# Altium project HE280PCB.PrjPcb
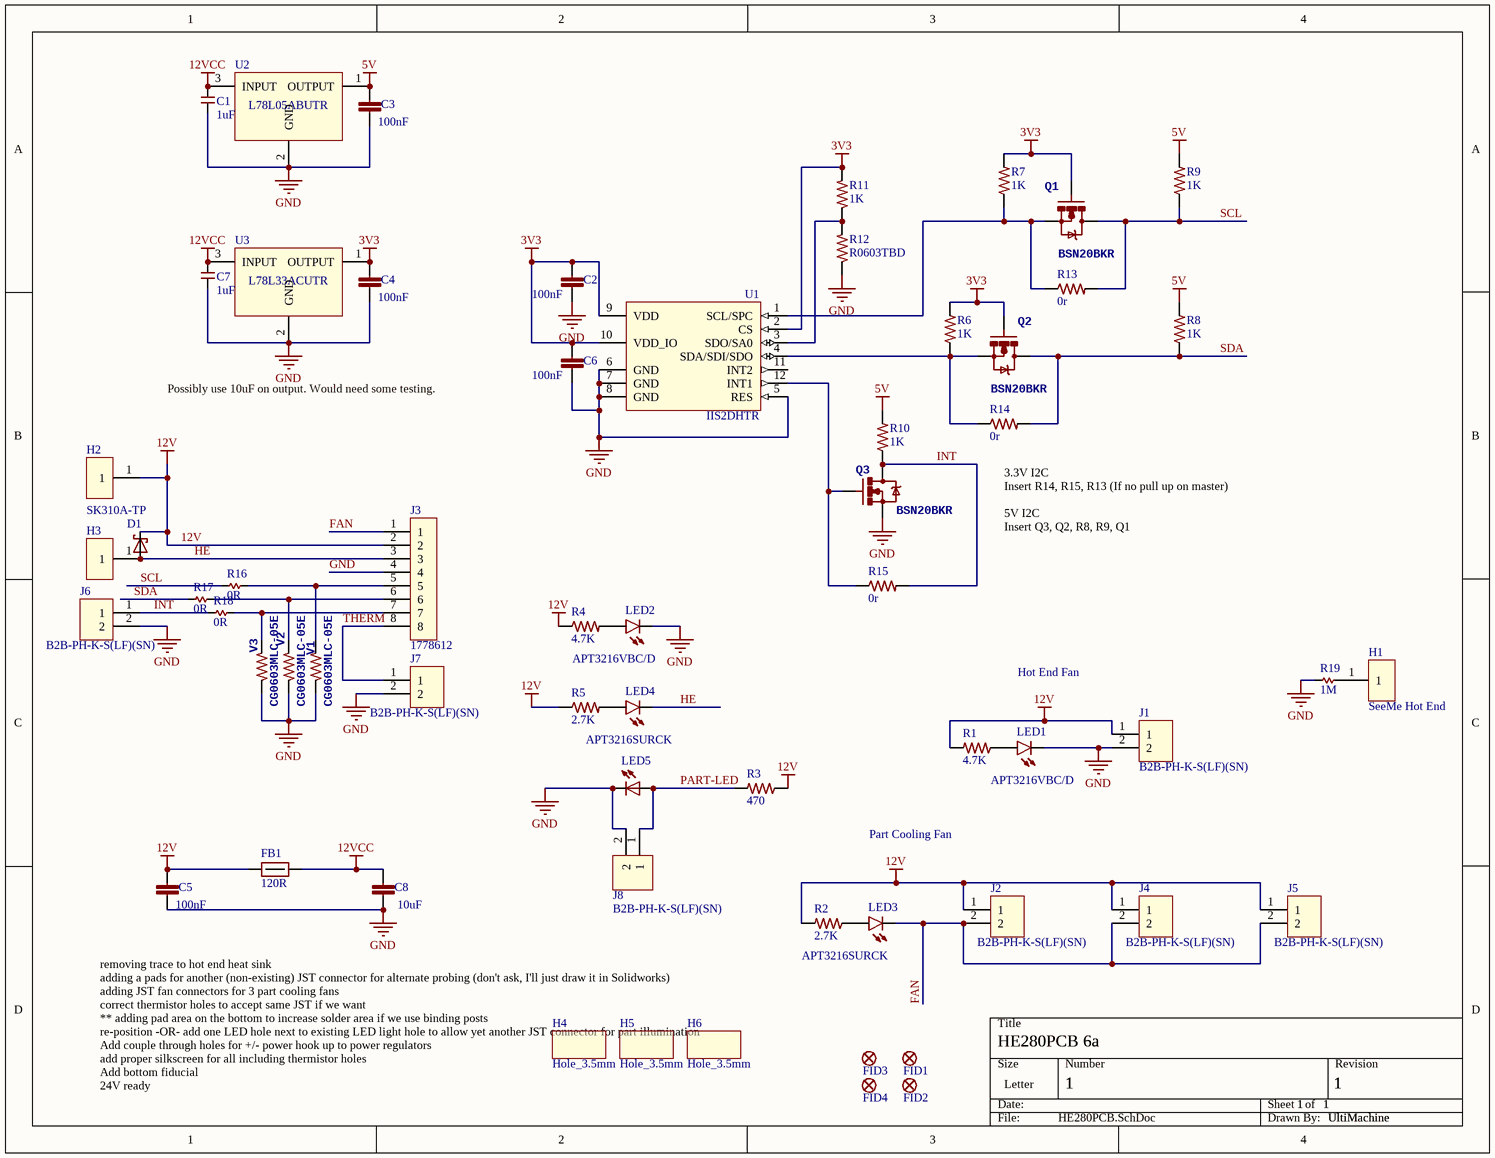
[diagram p0: HE280PCB.SchDoc]
projectDesigner: UltiMachine; projectDesigner: UltiMachine; projectdocumentNumber: 1; projectDocumentRevision: 1; projectTitle: HE280PCB; projectVersion: 6a
1 sheet, 61 parts. Net scope: global (net labels, ports and power ports of the same name join across sheets).
Board file: HE280PCB.PcbDoc

## Sheet HE280PCB.SchDoc
size Letter; SheetNumber: 1; SheetTotal: 1

### Parts
C1  1uF  [C0805]
C2  100nF  [C0603]
C3  100nF  [C0603]
C4  100nF  [C0603]
C5  100nF  [C0603]
C6  100nF  [C0603]
C7  1uF  [C0805]
C8  10uF  [C0805]
D1  SK310A-TP  [SMA-SM]
FB1  120R  [R0402]
FID1  FIDUCIAL  [FIDUCIAL-2x3-Panel]  (value not drawn)
FID2  FIDUCIAL  [FIDUCIAL-2x3-Panel]  (value not drawn)
FID3  FIDUCIAL  [FIDUCIAL-2x3-Panel]  (value not drawn)
FID4  FIDUCIAL  [FIDUCIAL-2x3-Panel]  (value not drawn)
H1  SeeMe Hot End  [PAD 0.1-HOTEND]
H2  PTH 49mil  [PTH 49mil]  (value not drawn)
H3  PTH 49mil  [PTH 49mil]  (value not drawn)
H4  Hole_3.5mm  [Hole_3.5mm]
H5  Hole_3.5mm  [Hole_3.5mm]
H6  Hole_3.5mm  [Hole_3.5mm]
J1  B2B-PH-K-S(LF)(SN)  [B2B-PH-K-S(LF)(SN)]
J2  B2B-PH-K-S(LF)(SN)  [B2B-PH-K-S(LF)(SN)]
J3  1778612  [1778612]
J4  B2B-PH-K-S(LF)(SN)  [B2B-PH-K-S(LF)(SN)]
J5  B2B-PH-K-S(LF)(SN)  [B2B-PH-K-S(LF)(SN)]
J6  B2B-PH-K-S(LF)(SN)  [B2B-PH-K-S(LF)(SN)]
J7  B2B-PH-K-S(LF)(SN)  [B2B-PH-K-S(LF)(SN)]
J8  B2B-PH-K-S(LF)(SN)  [B2B-PH-K-S(LF)(SN)]
LED1  APT3216VBC/D  [LED1206]
LED2  APT3216VBC/D  [LED1206]
LED3  APT3216SURCK  [LED1206]
LED4  APT3216SURCK  [LED1206]
LED5  LED-Hot End  [HE LED]  (value not drawn)
Q1  BSN20BKR  [SOT23-3]
Q2  BSN20BKR  [SOT23-3]
Q3  BSN20BKR  [SOT23-3]
R1  4.7K  [R0805]
R2  2.7K  [R0805]
R3  470  [R0805]
R4  4.7K  [R0805]
R5  2.7K  [R0805]
R6  1K  [R0603]
R7  1K  [R0603]
R8  1K  [R0603]
R9  1K  [R0603]
R10  1K  [R0603]
R11  1K  [R0603]
R12  R0603TBD  [R0603]
R13  0r  [R0603]
R14  0r  [R0603]
R15  0r  [R0603]
R16  0R  [R0402]
R17  0R  [R0402]
R18  0R  [R0402]
R19  1M  [R0402]
U1  IIS2DHTR  [LGA12C50P4X4_200X200X100]
U2  L78L05ABUTR  [SOT89-150P347X160-3L]
U3  L78L33ACUTR  [SOT89-150P347X160-3L]
V1  CG0603MLC-05E  [R0603]
V2  CG0603MLC-05E  [R0603]
V3  CG0603MLC-05E  [R0603]

### Nets
3V3: C2.1 C4.1 C6.1 Q1.1(G) Q2.1(G) R6.2 R7.2 R11.2 U1.2(CS) U1.9(VDD) U1.10(VDD_IO) U3.1(OUTPUT)
5V: C3.1 R8.2 R9.2 R10.2 U2.1(OUTPUT)
12V: C5.1 D1.C FB1.1 H2.1 J1.1 J2.1 J3.2 J4.1 J5.1 R1.2 R2.2 R3.1 R4.1 R5.1
12VCC: C1.1 C7.1 C8.1 FB1.2 U2.3(INPUT) U3.3(INPUT)
GND: C1.2 C2.2 C3.2 C4.2 C5.2 C6.2 C7.2 C8.2 J1.2 J3.4 J6.2 J7.2 J8.2 LED1.C LED2.C LED5.C Q3.2(S) R12.1 R19.1 U1.5(RES) U1.6(GND) U1.7(GND) U1.8(GND) U2.2(GND) U3.2(GND) V1.1 V2.1 V3.1
FAN: J2.2 J3.1 J4.2 J5.2 LED3.C
HE: D1.A H3.1 J3.3 LED4.C
INT: J6.1 Q3.3(D) R10.1 R15.2 R18.1
PART-LED: J8.1 LED5.A R3.2
SCL: Q1.3(D) R9.1 R13.2 R16.1
SDA: Q2.3(D) R8.1 R14.2 R17.1
THERM: J3.8 J7.1
NetH1_1: H1.1 R19.2
NetJ3_5: J3.5 R16.2 V1.2
NetJ3_6: J3.6 R17.2 V2.2
NetJ3_7: J3.7 R18.2 V3.2
NetLED1_A: LED1.A R1.1
NetLED2_A: LED2.A R4.2
NetLED3_A: LED3.A R2.1
NetLED4_A: LED4.A R5.2
NetQ1_2: Q1.2(S) R7.1 R13.1 U1.1(SCL/SPC)
NetQ2_2: Q2.2(S) R6.1 R14.1 U1.4(SDA/SDI/SDO)
NetQ3_1: Q3.1(G) R15.1 U1.12(INT1)
NetR11_1: R11.1 R12.2 U1.3(SDO/SA0)

Not connected (* = marked no-connect by the designer): U1 11(INT2)

### Notes on the sheet
- Possibly use 10uF on output. Would need some testing.
- (near R14) 3.3V I2C
  Insert R14, R15, R13 (If no pull up on master)
  5V I2C
  Insert Q3, Q2, R8, R9, Q1
- Hot End Fan
- Part Cooling Fan
- removing trace to hot end heat sink
  adding a pads for another (non-existing) JST connector for alternate probing (don't ask, I'll just draw it in Solidworks)
  adding JST fan connectors for 3 part cooling fans
  correct thermistor holes to accept same JST if we want
  ** adding pad area on the bottom to increase solder area if we use binding posts
  re-position -OR- add one LED hole next to existing LED light hole to allow yet another JST connector for part illumination
  Add couple through holes for +/- power hook up to power regulators
  add proper silkscreen for all including thermistor holes
  Add bottom fiducial
  24V ready

### Library data of the parts
C1 C7 = 1uF 0805 50V X7R: CAP CER 0805 1uF 50V 10% X7R; MANUFACTURER: Murata; MANUFACTURER #: GRM21BR71H105KA12L; PART: 1uF 50V X7R 0805; PART DESCRIPTION: 1µF ±10% 50V Ceramic Capacitor X7R 0805 (2012 Metric); DISTRIBUTOR #: 490-4736-2-ND; DISTRIBUTOR: Digikey; TOLERANCE: 10%; EE_SPEC: 50V; VALUE: 1uF
C2-C6 = C0603C104K5RACTU: CAP CER 0603 100nF 50V 10% X7R; LastRevisionNote: ImportComponents; Published: 23-Apr-2014; Publisher: UltiMachine; LastRevisionDate: 23-Apr-2014; ManufacturerPartNumber: C0603C104K5RACTU; VALUE: 100nF
C8 = GRM21BR61C106KE15K: CAP CER 10UF 16V X5R 0805; LastRevisionNote: ImportComponents; Published: 23-Apr-2014; Publisher: UltiMachine; LastRevisionDate: 23-Apr-2014; ManufacturerPartNumber: GRM21BR61C106KE15K; VALUE: 10uF
D1 = SK310A: DIODE Schottky 3A SMA; LastRevisionNote: ImportComponents; LastRevisionDate: 23-Apr-2014; ManufacturerPartNumber: SK310A; Published: 23-Apr-2014; Publisher: UltiMachine
FB1 = FERRITE 120R 1A 0402: FERRITE BEAD 120 OHM 0402 1LN; MANUFACTURER: Taiyo Yuden; MANUFACTURER #: BKP1005HS121-T; VALUE: 120Rfb; TOLERANCE: -NA-; EE_SPEC: 1A; DISTRIBUTOR #: 587-1921-2-ND; DISTRIBUTOR: Digikey; PART: FERRITE 120R 1A 0402; PART DESCRIPTION: FERRITE BEAD 120 OHM 0402 1LN
FID1-FID4 = FIDUCIAL: LastRevisionNote: ImportComponents; Published: 23-Apr-2014; Publisher: UltiMachine; LastRevisionDate: 23-Apr-2014
J1 J2 J4-J8 = B2B-PH-K-S(LF)(SN): Conn JST 2 position
J3 = 1778612: Conn 2.5mm Pin in Paste Phoenix
LED1 LED2 = APT3216VBC/D: LED BLUE CLEAR 1206 SMD; LastRevisionNote: ImportComponents; Published: 23-Apr-2014; Publisher: UltiMachine; LastRevisionDate: 23-Apr-2014; VALUE: APT3216VBC/D
LED3 LED4 = APT3216SURCK: LED RED CLEAR 1206 SMD; LastRevisionNote: ImportComponents; Published: 23-Apr-2014; Publisher: UltiMachine; LastRevisionDate: 23-Apr-2014; VALUE: APT3216SURCK
Q1-Q3 = BSN20BKR: MOSFET N-CH 60V 0.265A SOT-23; LastRevisionNote: ImportComponents; Published: 23-Apr-2014; Publisher: UltiMachine; LastRevisionDate: 23-Apr-2014; ManufacturerPartNumber: BSN20BKR
R1 R4 = RC0805FR-074K7L: RES SMD 4.7K OHM 5% 1/8W 0805; LastRevisionNote: ImportComponents; Published: 23-Apr-2014; Publisher: UltiMachine; LastRevisionDate: 23-Apr-2014; VALUE: 4.7K
R2 R5 = RC0805FR-072K7L: RES SMD 2.7K OHM 5% 1/8W 0805; LastRevisionNote: ImportComponents; Published: 23-Apr-2014; Publisher: UltiMachine; LastRevisionDate: 23-Apr-2014; VALUE: 2.7K
R3 = RC0805JR-07470RL: RES SMD 470 OHM 5% 1/8W 0805; LastRevisionNote: ImportComponents; Published: 23-Apr-2014; Publisher: UltiMachine; LastRevisionDate: 23-Apr-2014; VALUE: 470
R6-R11 = ERJ-3EKF1001V: RES 0603 1K 100mW 1%; LastRevisionNote: ImportComponents; Published: 23-Apr-2014; Publisher: UltiMachine; LastRevisionDate: 23-Apr-2014; ManufacturerPartNumber: ERJ-3EKF1001V; VALUE: 1K
R12 = R0603TBD: Resistor; LastRevisionNote: ImportComponents; Published: 23-Apr-2014; Publisher: UltiMachine; LastRevisionDate: 23-Apr-2014; VALUE: R0603TBD
R13-R15 = CR0603J000ELF: RES 0603 0r 100mW 1%; LastRevisionNote: ImportComponents; VALUE: 0r; Published: 23-Apr-2014; Publisher: UltiMachine; LastRevisionDate: 23-Apr-2014; ManufacturerPartNumber: CR0603J000ELF
R16-R18 = 0R 0402: RES SMD 0.0OHM JUMPER 1/10W 0402; MANUFACTURER: Panasonic; MANUFACTURER #: ERJ-2GE0R00X; PART DESCRIPTION: 0.0 Ohm Jumper 0.1W, 1/10W Chip Resistor 0402 (1005 Metric) Automotive AEC-Q200 Thick Film; MANUFACTURER2#: RC0402JR-070RL; TOLERANCE: 1%; VALUE: 0R; DISTRIBUTOR #: P0.0JTR-ND; DISTRIBUTOR: Digikey; PART: 0R
R19 = 1M 5% 0402: RES 0402 1M 100mW 5%; MANUFACTURER: Panasonic; MANUFACTURER #: ERJ2GEJ105X; PART DESCRIPTION: 1M Ohm ±5% 0.1W, 1/10W Chip Resistor 0402 (1005 Metric) Automotive AEC-Q200 Thick Film; EE_SPEC: 1/10W; DISTRIBUTOR #: P1.0MJTR-ND; DISTRIBUTOR: Digikey; PART: 1M 5% 0402; TOLERANCE: 5%; VALUE: 1M
U1 = IIS2DHTR: 3-axis accelerometer with digital output
U2 = L78L05ABUTR: IC REG LDO 5V 0.1A SOT89-3
U3 = L78L33ACUTR: IC REG LDO 3.3V 0.1A SOT89-3
V1-V3 = R-US_R0603: RESISTOR, American symbol

## Assembly variants
HE280PCB 3.3V: not fitted J6 J7 J8 Q1 Q2 Q3 R6 R7 R8 R9 R10 R12
HE280PCB 5V: not fitted J6 J7 J8 R12 R13 R14 R15